# EAGLE design LPC_1 (EAGLE 6.4)
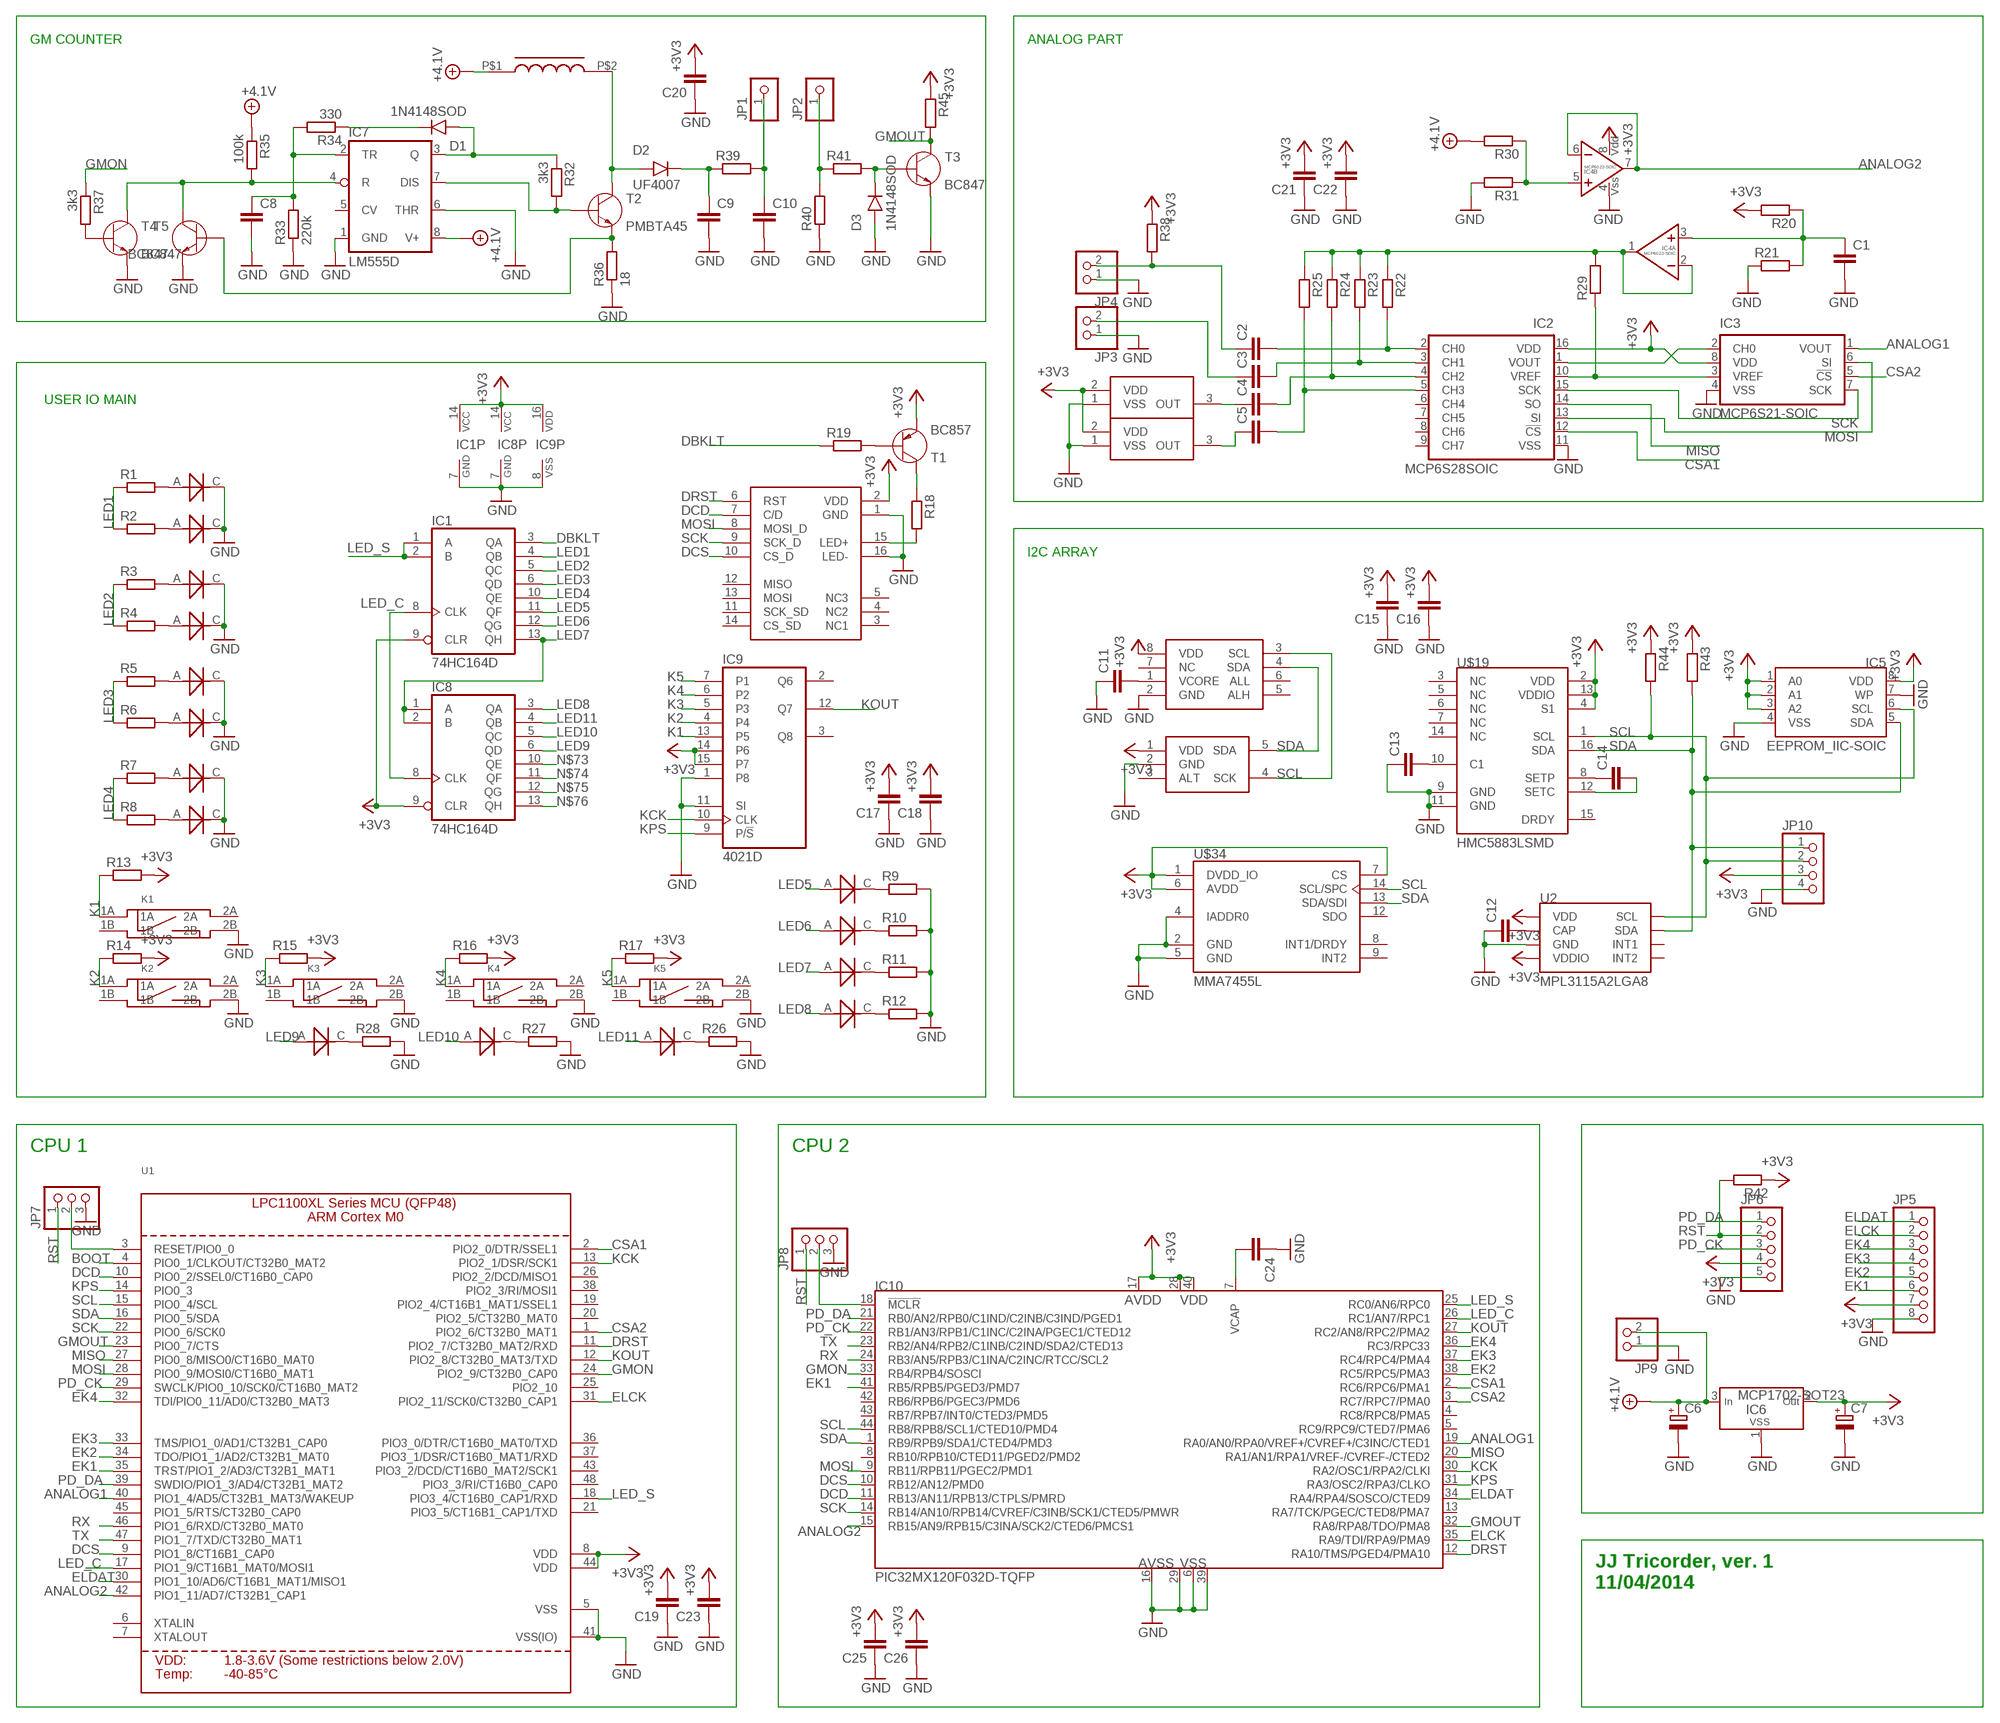
[diagram p0: schematic, sheet 1]

## Parts
C1  C_0806  [R0805]
C2  C_1206  [R1206]
C3  C_1206  [R1206]
C4  C_1206  [R1206]
C5  C_1206  [R1206]
C6  CPOL-EUSMCA  [SMC_A]
C7  CPOL-EUSMCA  [SMC_A]
C8  C_0806  [R0805]
C9  C_1206  [R1206]
C10  C_1206  [R1206]
C11  C_0806  [R0805]
C12  C_0806  [R0805]
C13  C_0806  [R0805]
C14  C_0806  [R0805]
C15  C_0806  [R0805]
C16  C_0806  [R0805]
C17  C_0806  [R0805]
C18  C_0806  [R0805]
C19  C_0806  [R0805]
C20  C_0806  [R0805]
C21  C_0806  [R0805]
C22  C_0806  [R0805]
C23  C_0806  [R0805]
C24  C_0806  [R0805]
C25  C_0806  [R0805]
C26  C_0806  [R0805]
D1  1N4148SOD  [SOD-80]
D2  UF4007  1N4007-SM  [SM-1]
D3  1N4148SOD  [SOD-80]
IC1  74HC164D  [SO14]
IC2  MCP6S28SOIC  [SO-16]
IC3  MCP6S21-SOIC  [SO-08]
IC4  MCP6022-SOIC  [SO-08]
IC5  EEPROM_IIC-SOIC  [SO-08]
IC6  MCP1702-SOT23  [SOT23]
IC7  LM555D  [SO08]
IC8  74HC164D  [SO14]
IC9  4021D  [SO16]
IC10  PIC32MX120F032D-TQFP  [TQFP44]
JP1  PINHD-1X1  [1X01]
JP2  PINHD-1X1  [1X01]
JP3  PINHD-1X02_2.54  [1X02]
JP4  PINHD-1X02_2.54  [1X02]
JP5  PINHD-1X08_2.54-S  [1X08-S]
JP6  PINHD-1X05_2.54-90°-S  [1X05/90-S]
JP7  PINHD-1X03_2.00  [1X03M]
JP8  PINHD-1X03_2.00  [1X03M]
JP9  PINHD-1X02_2.54-90°  [1X02/90]
JP10  PINHD-1X04_2.00  [1X04M]
K1  SWITCH_BD_B  [SW_SMD2]
K2  SWITCH_BD_B  [SW_SMD2]
K3  SWITCH_BD_B  [SW_SMD2]
K4  SWITCH_BD_B  [SW_SMD2]
K5  SWITCH_BD_B  [SW_SMD2]
R1  R_0805  [R0805]
R2  R_0805  [R0805]
R3  R_0805  [R0805]
R4  R_0805  [R0805]
R5  R_0805  [R0805]
R6  R_0805  [R0805]
R7  R_0805  [R0805]
R8  R_0805  [R0805]
R9  R_0805  [R0805]
R10  R_0805  [R0805]
R11  R_0805  [R0805]
R12  R_0805  [R0805]
R13  R_0805  [R0805]
R14  R_0805  [R0805]
R15  R_0805  [R0805]
R16  R_0805  [R0805]
R17  R_0805  [R0805]
R18  R_0805  [R0805]
R19  R_0805  [R0805]
R20  R_0805  [R0805]
R21  R_0805  [R0805]
R22  R_0805  [R0805]
R23  R_0805  [R0805]
R24  R_0805  [R0805]
R25  R_0805  [R0805]
R26  R_0805  [R0805]
R27  R_0805  [R0805]
R28  R_0805  [R0805]
R29  R_0805  [R0805]
R30  R_0805  [R0805]
R31  R_0805  [R0805]
R32  3k3  R_0805  [R0805]
R33  220k  R_0805  [R0805]
R34  330  R_0805  [R0805]
R35  100k  R_0805  [R0805]
R36  18  R_0805  [R0805]
R37  3k3  R_0805  [R0805]
R38  R_0805  [R0805]
R39  R_1206  [R1206]
R40  R_1206  [R1206]
R41  R_0805  [R0805]
R42  R_0805  [R0805]
R43  R_0805  [R0805]
R44  R_0805  [R0805]
R45  R_0805  [R0805]
T1  BC857  [SOT23]
T2  PMBTA45  BC847  [SOT23]
T3  BC847  [SOT23]
T4  BC847  [SOT23]
T5  BC847  [SOT23]
U1  LPC1113/4/5_QFP48_XLSERIES  [LQFP48]
U2  MPL3115A2LGA8  [LGA8]
U$1  LED5X2  [LED_5X2]
U$2  LED5X5  [LED_5X5]
U$3  DISP_TFT_18  [DSIP_TFT_18]
U$4  LED5X5  [LED_5X5]
U$5  LED5X5  [LED_5X5]
U$6  LED5X5  [LED_5X5]
U$7  LED5X5  [LED_5X5]
U$8  LED5X5  [LED_5X5]
U$9  LED5X5  [LED_5X5]
U$10  LED5X5  [LED_5X5]
U$11  LED5X2  [LED_5X2]
U$12  LED5X2  [LED_5X2]
U$13  LED5X2  [LED_5X2]
U$14  LED5X2  [LED_5X2]
U$15  LED5X2  [LED_5X2]
U$16  LED5X2  [LED_5X2]
U$17  HIH-6130  [SO8]
U$18  MCP9800  [SOT23-5]
U$19  HMC5883LSMD  [16LPCC]
U$20  IND_DL22  [IND_DL22]
U$21  TSL252  [TSL252]
U$22  TSL252  [TSL252]
U$34  MMA7455L  [LGA14]

## Nets
+3V3: C7.+ C15.2 C16.2 C17.2 C18.2 C19.2 C20.2 C21.2 C22.2 C23.2 C25.2 C26.2 IC1.9(CLR) IC1.14(VCC) IC2.16(VDD) IC3.8(VDD) IC4.8(VDD) IC5.1(A0) IC5.2(A1) IC5.3(A2) IC5.8(VDD) IC6.2(OUT) IC8.9(CLR) IC8.14(VCC) IC9.14(P6) IC9.15(P7) IC9.16(VDD) IC10.17(AVDD) IC10.28(VDD) IC10.40(VDD2) JP5.7 JP6.4 JP10.3 R13.2 R14.2 R15.2 R16.2 R17.2 R20.2 R38.1 R42.1 R43.1 R44.1 R45.1 T1.3(C) U1.8(VDD) U1.44(VDD) U2.1(VDD) U2.4(VDDIO) U$3.2(VDD) U$17.8(VDD) U$18.1(VDD) U$19.2(VDD) U$19.4(S1) U$19.13(VDDIO) U$21.2(VDD) U$22.2(VDD) U$34.1(DVDD_IO) U$34.6(AVDD) U$34.7(CS)
+4.1V: C6.+ IC6.3(IN) IC7.8(V+) JP9.2 R30.2 R35.1 U$20.P$1
ANALOG1: IC3.1(VOUT) IC10.19(RA0/AN0/RPA0/VREF+/CVREF+/C3INC/CTED1) U1.40(PIO1_4/AD5/CT32B1_MAT3/WAKEUP)
ANALOG2: IC4.6(B:IN-) IC4.7(B:VYSTUP) IC10.15(RB15/AN9/RPB15/C3INA/SCK2/CTED6/PMCS1) U1.42(PIO1_11/AD7/CT32B1_CAP1)
BOOT: U1.4(PIO0_1/CLKOUT/CT32B0_MAT2)
CSA1: IC2.12(!CS) IC10.2(RC6/RPC6/PMA1) U1.2(PIO2_0/DTR/SSEL1)
CSA2: IC3.5(!CS) IC10.3(RC7/RPC7/PMA0) U1.1(PIO2_6/CT32B0_MAT1)
DBKLT: IC1.3(QA) R19.1
DCD: IC10.11(RB13/AN11/RPB13/CTPLS/PMRD) U1.10(PIO0_2/SSEL0/CT16B0_CAP0) U$3.7(C/D)
DCS: IC10.10(RB12/AN12/PMD0) U1.9(PIO1_8/CT16B1_CAP0) U$3.10(CS_D)
DRST: IC10.12(RA10/TMS/PGED4/PMA10) U1.11(PIO2_7/CT32B0_MAT2/RXD) U$3.6(RST)
EK1: IC10.41(RB5/RPB5/PGED3/PMD7) JP5.6 U1.35(TRST/PIO1_2/AD3/CT32B1_MAT1)
EK2: IC10.38(RC5/RPC5/PMA3) JP5.5 U1.34(TDO/PIO1_1/AD2/CT32B1_MAT0)
EK3: IC10.37(RC4/RPC4/PMA4) JP5.4 U1.33(TMS/PIO1_0/AD1/CT32B1_CAP0)
EK4: IC10.36(RC3/RPC33) JP5.3 U1.32(TDI/PIO0_11/AD0/CT32B0_MAT3)
ELCK: IC10.35(RA9/TDI/RPA9/PMA9) JP5.2 U1.31(PIO2_11/SCK0/CT32B0_CAP1)
ELDAT: IC10.34(RA4/RPA4/SOSCO/CTED9) JP5.1 U1.30(PIO1_10/AD6/CT16B1_MAT1/MISO1)
GMON: IC10.33(RB4/RPB4/SOSCI) R37.1 U1.24(PIO2_9/CT32B0_CAP0)
GMOUT: IC10.32(RA8/RPA8/TDO/PMA8) R45.2 T3.3(C) U1.23(PIO0_7/CTS)
GND: C1.2 C6.- C7.- C8.2 C9.2 C10.2 C11.1 C12.1 C13.1 C15.1 C16.1 C17.1 C18.1 C19.1 C20.1 C21.1 C22.1 C23.1 C24.1 C25.1 C26.1 D3.A IC1.7(GND) IC2.11(VSS) IC3.4(VSS) IC4.4(VSS) IC5.4(VSS) IC5.7(WP) IC6.1(VSS) IC7.1(GND) IC7.6(THR) IC8.7(GND) IC9.1(P8) IC9.8(VSS) IC9.11(SI) IC10.6(VSS1) IC10.16(AVSS) IC10.29(VSS) IC10.39(VSS2) JP3.1 JP4.1 JP5.8 JP6.5 JP7.3 JP8.3 JP9.1 JP10.4 K1.2B K2.2B K3.2B K4.2B K5.2B R9.2 R10.2 R11.2 R12.2 R21.1 R26.2 R27.2 R28.2 R31.2 R33.1 R36.1 R40.1 T3.2(E) T4.2(E) T5.2(E) U1.5(VSS) U1.41(VSS(IO)) U2.3(GND) U$2.C U$3.1(GND) U$3.16(LED-) U$4.C U$5.C U$6.C U$7.C U$8.C U$9.C U$10.C U$17.2(GND) U$18.2(GND) U$19.9(GND) U$19.11(GND) U$21.1(VSS) U$22.1(VSS) U$34.2(GND) U$34.4(IADDR0) U$34.5(GND)
K1: IC9.13(P5) K1.1A R13.1
K2: IC9.4 K2.1A R14.1
K3: IC9.5(P3) K3.1A R15.1
K4: IC9.6(P2) K4.1A R16.1
K5: IC9.7(P1) K5.1A R17.1
KCK: IC9.10(CLK) IC10.30(RA2/OSC1/RPA2/CLKI) U1.13(PIO2_1/DSR/SCK1)
KOUT: IC9.12(Q7) IC10.27(RC2/AN8/RPC2/PMA2) U1.12(PIO2_8/CT32B0_MAT3/TXD)
KPS: IC9.9(P/!S) IC10.31(RA3/OSC2/RPA3/CLKO) U1.14(PIO0_3)
LED1: IC1.4(QB) R1.1 R2.1
LED2: IC1.5(QC) R3.1 R4.1
LED3: IC1.6(QD) R5.1 R6.1
LED4: IC1.10(QE) R7.1 R8.1
LED5: IC1.11(QF) U$13.A
LED6: IC1.12(QG) U$1.A
LED7: IC1.13(QH) IC8.1(A) IC8.2(B) U$11.A
LED8: IC8.3(QA) U$12.A
LED9: IC8.6(QD) U$16.A
LED10: IC8.5(QC) U$15.A
LED11: IC8.4(QB) U$14.A
LED_C: IC1.8(CLK) IC8.8(CLK) IC10.26(RC1/AN7/RPC1) U1.17(PIO1_9/CT16B1_MAT0/MOSI1)
LED_S: IC1.1(A) IC1.2(B) IC10.25(RC0/AN6/RPC0) U1.18(PIO3_4/CT16B0_CAP1/RXD)
MISO: IC2.14(SO) IC10.20(RA1/AN1/RPA1/VREF-/CVREF-/CTED2) U1.27(PIO0_8/MISO0/CT16B0_MAT0)
MOSI: IC2.13(SI) IC3.6(SI) IC10.9(RB11/RPB11/PGEC2/PMD1) U1.28(PIO0_9/MOSI0/CT16B0_MAT1) U$3.8(MOSI_D)
N$1: R1.2 U$2.A
N$2: R2.2 U$4.A
N$3: IC2.10(VREF) IC3.3(VREF) R29.1
N$5: R3.2 U$5.A
N$6: R4.2 U$6.A
N$7: C1.1 IC4.3(A:NEIN+) R20.1 R21.2
N$8: IC2.1(VOUT) IC3.2(CH0)
N$9: R5.2 U$7.A
N$10: R6.2 U$8.A
N$11: R26.1 U$14.C
N$12: R18.2 U$3.15(LED+)
N$13: R7.2 U$9.A
N$14: R8.2 U$10.A
N$15: R18.1 T1.2(E)
N$16: R19.2 T1.1(B)
N$17: R9.1 U$13.C
N$18: R10.1 U$1.C
N$19: R11.1 U$11.C
N$20: R12.1 U$12.C
N$21: C2.2 IC2.2(CH0) R22.2
N$22: C3.2 IC2.3(CH1) R23.2
N$23: C4.2 IC2.4(CH2) R24.2
N$24: C5.2 IC2.5(CH3) R25.2
N$25: R27.1 U$15.C
N$26: R28.1 U$16.C
N$28: IC4.1(A:VYSTUP) IC4.2(A:IN-) R22.1 R23.1 R24.1 R25.1 R29.2
N$31: IC4.5(B:NEIN+) R30.1 R31.1
N$32: D1.K R34.1
N$33: D1.A IC7.3(Q) R32.1
N$34: IC7.7(DIS) R32.2 T2.1(B)
N$35: IC7.4(R) R35.2 T4.3(C) T5.3(C)
N$36: C8.1 IC7.2(TR) R33.2 R34.2
N$37: R37.2 T4.1(B)
N$38: C9.1 D2.K R39.1
N$39: C10.1 JP1.1 R39.2
N$40: D2.A T2.3(C) U$20.P$2
N$41: JP2.1 R40.2 R41.1
N$42: D3.K R41.2 T3.1(B)
N$44: R36.2 T2.2(E) T5.1(B)
N$45: C11.2 U$17.1(VCORE)
N$46: C24.2 IC10.7(VCAP)
N$48: JP7.2 U1.3(RESET/PIO0_0)
N$51: C12.2 U2.2(CAP)
N$52: C13.2 U$19.10(C1)
N$53: C14.1 U$19.8(SETP)
N$54: C14.2 U$19.12(SETC)
N$55: C5.1 U$21.3(OUT)
N$56: C4.1 U$22.3(OUT)
N$57: IC10.18(!MCLR) JP8.2
N$58: C3.1 JP3.2
N$59: C2.1 JP4.2 R38.2
N$73: IC8.10(QE)
N$74: IC8.11(QF)
N$75: IC8.12(QG)
N$76: IC8.13(QH)
PD_CK: IC10.22(RB1/AN3/RPB1/C1INC/C2INA/PGEC1/CTED12) JP6.3 U1.29(SWCLK/PIO0_10/SCK0/CT16B0_MAT2)
PD_DA: IC10.21(RB0/AN2/RPB0/C1IND/C2INB/C3IND/PGED1) JP6.1 U1.39(SWDIO/PIO1_3/AD4/CT32B1_MAT2)
RST: JP6.2 JP7.1 JP8.1 R42.2
RX: IC10.24(RB3/AN5/RPB3/C1INA/C2INC/RTCC/SCL2) U1.46(PIO1_6/RXD/CT32B0_MAT0)
SCK: IC2.15(SCK) IC3.7(SCK) IC10.14(RB14/AN10/RPB14/CVREF/C3INB/SCK1/CTED5/PMWR) U1.22(PIO0_6/SCK0) U$3.9(SCK_D)
SCL: IC5.6(SCL) IC10.44(RB8/RPB8/SCL1/CTED10/PMD4) JP10.2 R44.2 U1.15(PIO0_4/SCL) U2.8(SCL) U$17.3(SCL) U$18.4(SCK) U$19.1(SCL) U$34.14(SCL/SPC)
SDA: IC5.5(SDA) IC10.1(RB9/RPB9/SDA1/CTED4/PMD3) JP10.1 R43.2 U1.16(PIO0_5/SDA) U2.7(SDA) U$17.4(SDA) U$18.5(SDA) U$19.16(SDA) U$34.13(SDA/SDI)
TX: IC10.23(RB2/AN4/RPB2/C1INB/C2IND/SDA2/CTED13) U1.47(PIO1_7/TXD/CT32B0_MAT1)
Unconnected: IC2.6(CH4) IC2.7(CH5) IC2.8(CH6) IC2.9(CH7) IC7.5(CV) IC9.2(Q6) IC9.3(Q8) IC10.4(RC8/RPC8/PMA5) IC10.5(RC9/RPC9/CTED7/PMA6) IC10.8(RB10/RPB10/CTED11/PGED2/PMD2) IC10.13(RA7/TCK/PGEC/CTED8/PMA7) IC10.42(RB6/RPB6/PGEC3/PMD6) IC10.43(RB7/RPB7/INT0/CTED3/PMD5) K1.1B K1.2A K2.1B K2.2A K3.1B K3.2A K4.1B K4.2A K5.1B K5.2A U1.6(XTALIN) U1.7(XTALOUT) U1.19(PIO2_4/CT16B1_MAT1/SSEL1) U1.20(PIO2_5/CT32B0_MAT0) U1.21(PIO3_5/CT16B1_CAP1/TXD) U1.25(PIO2_10) U1.26(PIO2_2/DCD/MISO1) U1.36(PIO3_0/DTR/CT16B0_MAT0/TXD) U1.37(PIO3_1/DSR/CT16B0_MAT1/RXD) U1.38(PIO2_3/RI/MOSI1) U1.43(PIO3_2/DCD/CT16B0_MAT2/SCK1) U1.45(PIO1_5/RTS/CT32B0_CAP0) U1.48(PIO3_3/RI/CT16B0_CAP0) U2.5(INT2) U2.6(INT1) U$3.3(NC1) U$3.4(NC2) U$3.5(NC3) U$3.11(SCK_SD) U$3.12(MISO) U$3.13(MOSI) U$3.14(CS_SD) U$17.5(ALH) U$17.6(ALL) U$17.7(NC) U$18.3(ALT) U$19.3(NC) U$19.5(NC) U$19.6(NC) U$19.7(NC) U$19.14(NC) U$19.15(DRDY) U$34.8(INT1/DRDY) U$34.9(INT2) U$34.12(SDO)

## Notes on the sheet
- GM COUNTER | ANALOG PART
- USER IO MAIN
- I2C ARRAY
- CPU 1 | CPU 2
- JJ Tricorder, ver. 1
  11/04/2014

## Library data of the parts
C1-C5 C8-C26 = _moja:C
C6 C7 = _rcl:CPOL-EU: POLARIZED CAPACITOR, European symbol
D1 D3 = _mcom4:1N4148
D2 = _mcom4:1N4007
IC1 IC8 = 74xx-eu:74*164: 8-bit parallel out SHIFT REGISTER
IC2 = _mcom5:MCP6S28
IC3 = _mcom5:MCP6S21
IC4 = _mcom5:MCP6022
IC5 = _mcom5:EEPROM_IIC
IC6 = _mcom5:MCP1702
IC7 = _linear:*555: TIMER
IC9 = 40xx:4021: 8-bit static SHIFT REGISTER
IC10 = _mcom5:PIC32MX120F032D
JP1 JP2 = pinhead:PINHD-1X1: PIN HEADER
JP3 JP4 JP9 = pinhead-2:PINHD-1X02: PIN HEADER
JP5 = pinhead-2:PINHD-1X08: PIN HEADER
JP6 = pinhead-2:PINHD-1X05: PIN HEADER
JP7 JP8 = pinhead-2:PINHD-1X03: PIN HEADER
JP10 = pinhead-2:PINHD-1X04: PIN HEADER
K1-K5 = _moja:SWITCH_BD
R1-R45 = _moja:R
T1 = _mcom5:BC857
T2-T5 = _mcom4:BC847
U1 = microbuilder:LPC1113/4/5_QFP48_XLSERIES: LPC1113/4/5 ARM Cortex M0 MCU (50MHz) - XL Series (FBD48/3x3) LPC1115FBD48/303: Max Frequency: 50MHz Flash: 64kB SRAM: 8kB ADC: 10-bit
U2 = SparkFun-Sensors:MPL3115A2: Altimeter/Pressure Sensor, I2C, 1.95V-3.6V supply, 50 to 110kPa
U$1 U$2 U$4-U$16 = _moja:LED
U$3 = _moja:DISP_TFT_18
U$17 = _moja:HIH-6130
U$18 = _moja:MCP9800
U$19 = SparkFun-Sensors:HMC5883L: 3 Axis Digital Compass IC
U$20 = _moja:IND_DL22
U$21 U$22 = _moja:TSL252
U$34 = mma7455l:MMA7455L: The MMA7455L is a Digital Output (I2C/SPI), low power, low profile capacitive micromachined accelerometer featuring signal conditioning, a low pass filter, temperature compensation, self-test, configurable to detect 0g through interrupt pins (INT1 or INT2), and pulse detect for quick motion detection.

## Board
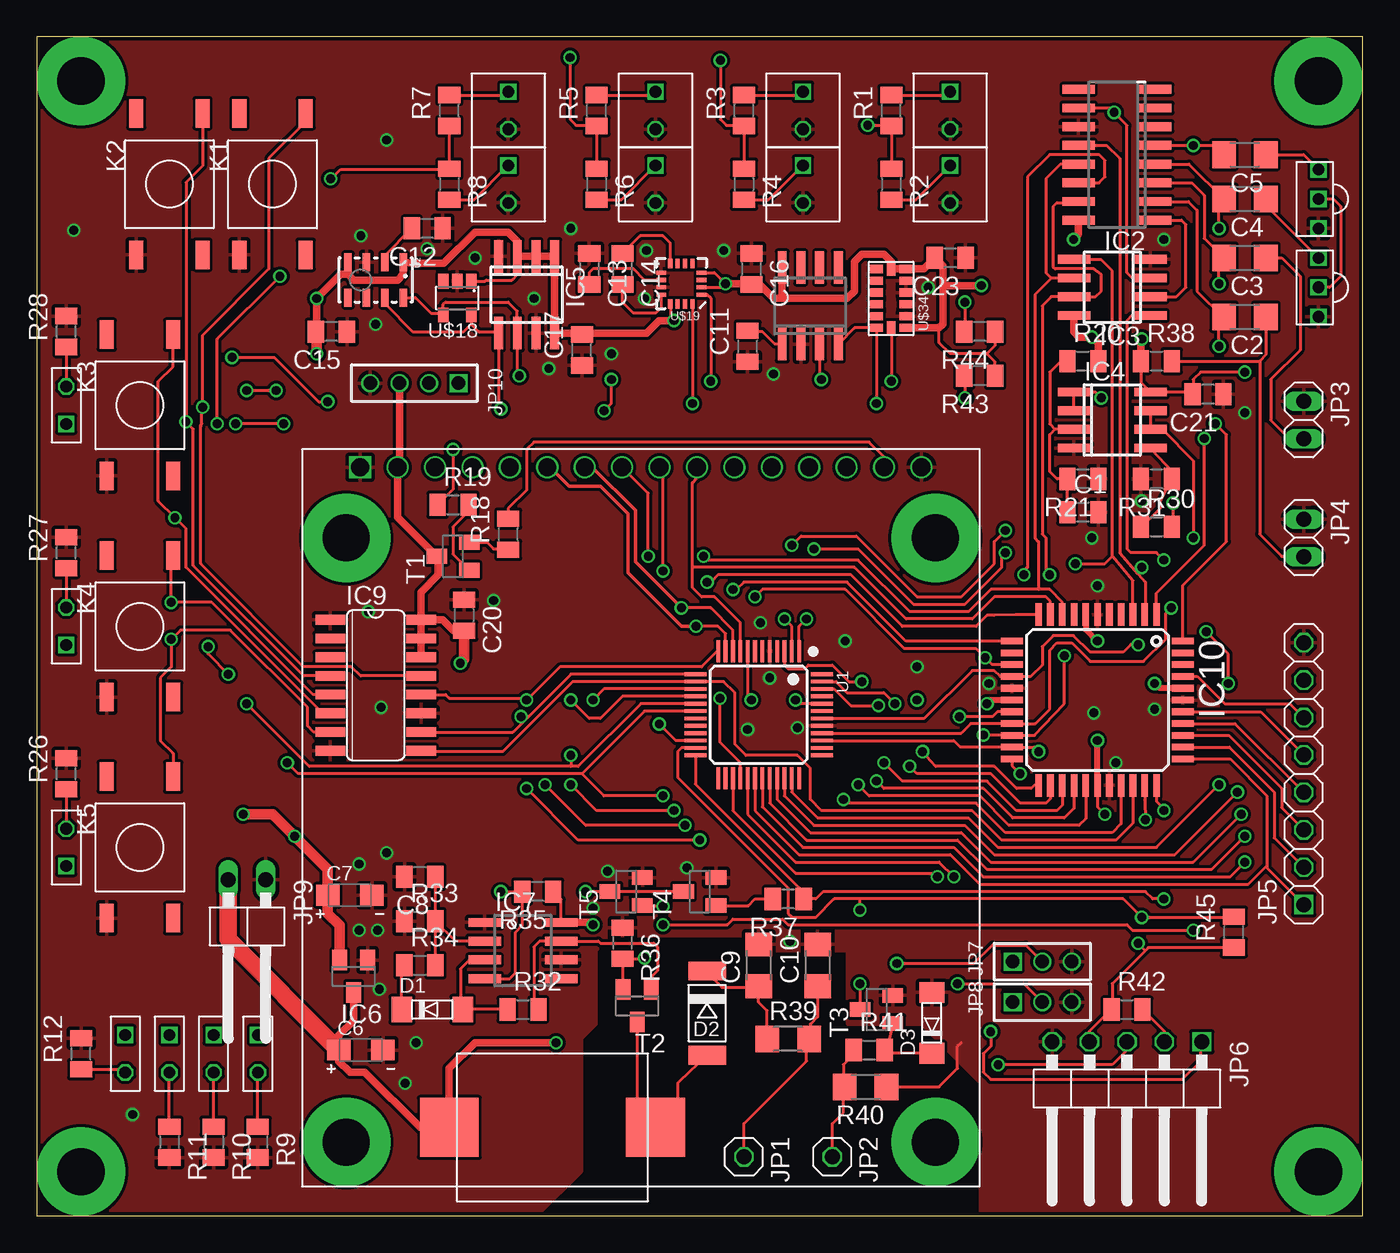
[diagram p1: board, top side]
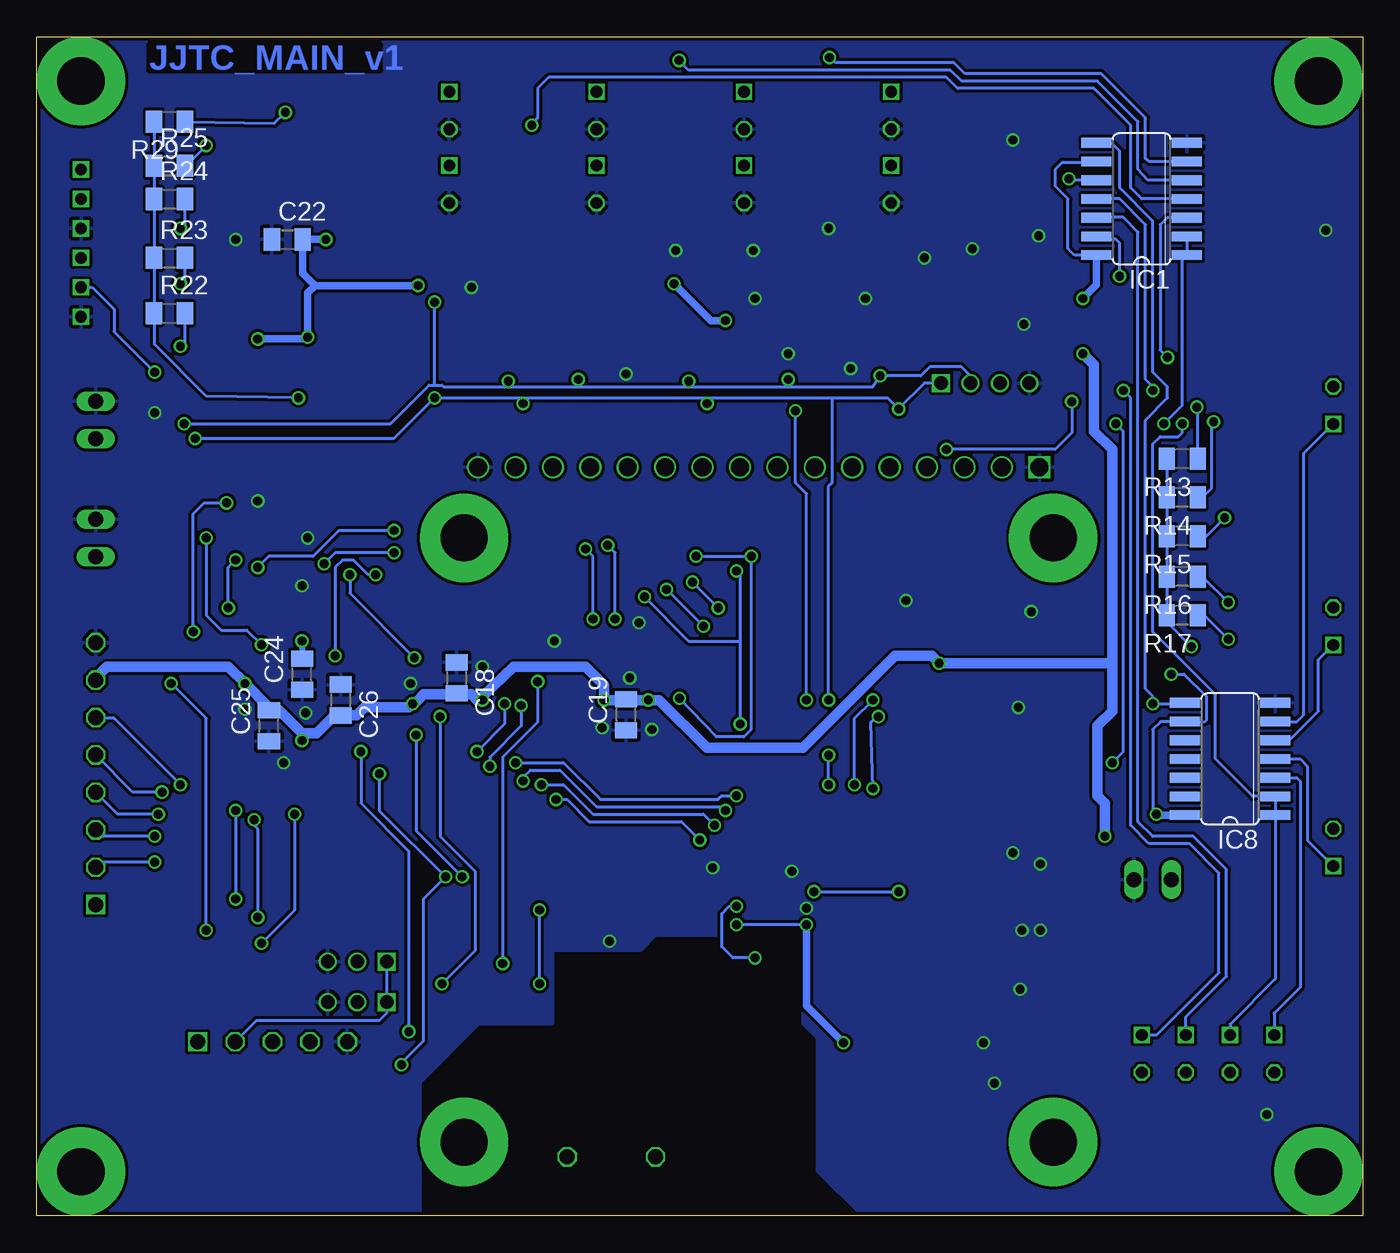
[diagram p2: board, bottom side, seen from below]

Size 90 x 80 mm. Coordinates in mm from the lower left corner, seen from the top.
Outline: 0,80 0,0 90,0 90,80 0,80
Copper layers (1*16): Top 0.035mm / dielectric 1.5mm / Bottom 0.035mm
Design rules "ch_6": minimum track width 0.15mm, minimum drill 0.4mm, track to track 0.2mm, track to pad 0.2mm, pad to pad 0.2mm, via to via 0.2mm, smd to smd 0.2mm, copper to edge 10mil, drill to drill 8mil, minimum pad ring 0.15mm, minimum via ring 0.15mm, stop-mask expansion 4mil, vias tented up to drill 0mil, thermal gap 10mil

### Footprints (pad centres in the part's own frame; a part is rotated, then mirrored left to right if it is on the bottom)
R0805 = smd 1.1 x 1.5: 1 -1.05,0; 2 1.05,0
R1206 = smd 1.6 x 1.803: 1 -1.422,0; 2 1.422,0
SMC_A = smd 1.6 x 1.4: + -1.5,0; - 1.5,0
SOD-80 = smd 1.397 x 1.702: A 1.905,0; K -2.223,0
SM-1 = smd 1.27 x 2.54: A 2.857,0; K -2.857,0
SO14 = smd 0.66 x 2.032: 1 -3.81,-3.073; 2 -2.54,-3.073; 3 -1.27,-3.073; 4 0,-3.073; 5 1.27,-3.073; 6 2.54,-3.073; 7 3.81,-3.073; 8 3.81,3.073; 9 2.54,3.073; 10 1.27,3.073; 11 0,3.073; 12 -1.27,3.073; 13 -2.54,3.073; 14 -3.81,3.073
SO-16 = smd 0.6 x 2.2: 1 -4.445,-2.917; 2 -3.175,-2.917; 3 -1.905,-2.917; 4 -0.635,-2.917; 5 0.635,-2.917; 6 1.905,-2.917; 7 3.175,-2.917; 8 4.445,-2.917; 9 4.445,2.283; 10 3.175,2.283; 11 1.905,2.283; 12 0.635,2.283; 13 -0.635,2.283; 14 -1.905,2.283; 15 -3.175,2.283; 16 -4.445,2.283
SO-08 = smd 0.6 x 2.2: 1 -1.905,-2.6; 2 -0.635,-2.6; 3 0.635,-2.6; 4 1.905,-2.6; 5 1.905,2.6; 6 0.635,2.6; 7 -0.635,2.6; 8 -1.905,2.6
SOT23 = smd 1 x 1.4: 1 -0.95,-1.1; 2 0.95,-1.1; 3 0,1.1
SO08 = smd 0.6 x 2.2: 1 -1.905,-2.6; 2 -0.635,-2.6; 3 0.635,-2.6; 4 1.905,-2.6; 5 1.905,2.6; 6 0.635,2.6; 7 -0.635,2.6; 8 -1.905,2.6
SO16 = smd 0.66 x 2.032: 1 -4.445,-3.073; 2 -3.175,-3.073; 3 -1.905,-3.073; 4 -0.635,-3.073; 5 0.635,-3.073; 6 1.905,-3.073; 7 3.175,-3.073; 8 4.445,-3.073; 9 4.445,3.073; 10 3.175,3.073; 11 1.905,3.073; 12 0.635,3.073; 13 -0.635,3.073; 14 -1.905,3.073; 15 -3.175,3.073; 16 -4.445,3.073
TQFP44 = smd 1.5 x 0.45: 1 -5.8,4; 2 -5.8,3.2; 3 -5.8,2.4; 4 -5.8,1.6; 5 -5.8,0.8; 6 -5.8,0; 7 -5.8,-0.8; 8 -5.8,-1.6; 9 -5.8,-2.4; 10 -5.8,-3.2; 11 -5.8,-4; 23 5.8,-4; 24 5.8,-3.2; 25 5.8,-2.4; 26 5.8,-1.6; 27 5.8,-0.8; 28 5.8,0; 29 5.8,0.8; 30 5.8,1.6; 31 5.8,2.4; 32 5.8,3.2; 33 5.8,4 | smd 0.45 x 1.5: 12 -4,-5.8; 13 -3.2,-5.8; 14 -2.4,-5.8; 15 -1.6,-5.8; 16 -0.8,-5.8; 17 0,-5.8; 18 0.8,-5.8; 19 1.6,-5.8; 20 2.4,-5.8; 21 3.2,-5.8; 22 4,-5.8; 34 4,5.8; 35 3.2,5.8; 36 2.4,5.8; 37 1.6,5.8; 38 0.8,5.8; 39 0,5.8; 40 -0.8,5.8; 41 -1.6,5.8; 42 -2.4,5.8; 43 -3.2,5.8; 44 -4,5.8
1X01 = drill 1.016 octagon: 1 0,0
1X02 = drill 1.016 long: 1 -1.27,0; 2 1.27,0
1X08-S = drill 1.016 square: 1 -8.89,0 | drill 1.016 octagon: 2 -6.35,0; 3 -3.81,0; 4 -1.27,0; 5 1.27,0; 6 3.81,0; 7 6.35,0; 8 8.89,0
1X05/90-S = drill 1.016 square: 1 -5.08,-3.81 | drill 1.016 octagon: 2 -2.54,-3.81; 3 0,-3.81; 4 2.54,-3.81; 5 5.08,-3.81
1X03M = drill 0.914 square: 1 -2,0 | drill 0.914: 2 0,0; 3 2,0
1X02/90 = drill 1.016 long: 1 -2.54,-3.81; 2 0,-3.81
1X04M = drill 0.914 square: 1 -3,0 | drill 0.914: 2 -1,0; 3 1,0; 4 3,0
SW_SMD2 = smd 1.93 x 0.965: 1A -4.8,2.25; 1B -4.8,-2.25; 2A 4.8,2.25; 2B 4.8,-2.25
LQFP48 = smd 1.5 x 0.25: 1 -4.3,2.75; 2 -4.3,2.25; 3 -4.3,1.75; 4 -4.3,1.25; 5 -4.3,0.75; 6 -4.3,0.25; 7 -4.3,-0.25; 8 -4.3,-0.75; 9 -4.3,-1.25; 10 -4.3,-1.75; 11 -4.3,-2.25; 12 -4.3,-2.75; 25 4.3,-2.75; 26 4.3,-2.25; 27 4.3,-1.75; 28 4.3,-1.25; 29 4.3,-0.75; 30 4.3,-0.25; 31 4.3,0.25; 32 4.3,0.75; 33 4.3,1.25; 34 4.3,1.75; 35 4.3,2.25; 36 4.3,2.75 | smd 0.25 x 1.5: 13 -2.75,-4.3; 14 -2.25,-4.3; 15 -1.75,-4.3; 16 -1.25,-4.3; 17 -0.75,-4.3; 18 -0.25,-4.3; 19 0.25,-4.3; 20 0.75,-4.3; 21 1.25,-4.3; 22 1.75,-4.3; 23 2.25,-4.3; 24 2.75,-4.3; 37 2.75,4.3; 38 2.25,4.3; 39 1.75,4.3; 40 1.25,4.3; 41 0.75,4.3; 42 0.25,4.3; 43 -0.25,4.3; 44 -0.75,4.3; 45 -1.25,4.3; 46 -1.75,4.3; 47 -2.25,4.3; 48 -2.75,4.3
LGA8 = smd 1.2 x 0.5: 1 -1.2,1.875; 2 -1.2,0.625; 3 -1.2,-0.625; 4 -1.2,-1.875; 5 1.2,-1.875; 6 1.2,-0.625; 7 1.2,0.625; 8 1.2,1.875
LED_5X2 = drill 0.8 square: A -1.27,0 | drill 0.8 octagon: C 1.27,0
LED_5X5 = drill 0.8 square: A -1.27,0 | drill 0.8 octagon: C 1.27,0
DSIP_TFT_18 = drill 1.2 square: 1 20.05,-23.8 | drill 1.2: 2 17.51,-23.8; 3 14.97,-23.8; 4 12.43,-23.8; 5 9.89,-23.8; 6 7.35,-23.8; 7 4.81,-23.8; 8 2.27,-23.8; 9 -0.27,-23.8; 10 -2.81,-23.8; 11 -5.35,-23.8; 12 -7.89,-23.8; 13 -10.43,-23.8; 14 -12.97,-23.8; 15 -15.51,-23.8; 16 -18.05,-23.8 | drill 3.2 pad 6: P$1 -19,-19; P$2 21,-19; P$3 -19,22; P$4 21,22
SO8 = smd 0.6 x 2.2: 1 -1.905,-2.6; 2 -0.635,-2.6; 3 0.635,-2.6; 4 1.905,-2.6; 5 1.905,2.6; 6 0.635,2.6; 7 -0.635,2.6; 8 -1.905,2.6
SOT23-5 = smd 0.7 x 1: 1 -0.99,-1.17; 2 -0.04,-1.17; 3 0.91,-1.17; 4 0.91,1.13; 5 -0.99,1.13
16LPCC = smd 0.65 x 0.28: 1 -1.37,0.75; 2 -1.37,0.25; 3 -1.37,-0.25; 4 -1.37,-0.75; 9 1.37,-0.75; 10 1.37,-0.25; 11 1.37,0.25; 12 1.37,0.75 | smd 0.28 x 0.65: 5 -0.75,-1.37; 6 -0.25,-1.37; 7 0.25,-1.37; 8 0.75,-1.37; 13 0.75,1.37; 14 0.25,1.37; 15 -0.25,1.37; 16 -0.75,1.37
IND_DL22 = smd 4 x 4: P$1 -7,0; P$2 7,0
TSL252 = drill 0.8 square: 1 2,0; 2 0,0; 3 -2,0
LGA14 = smd 0.9 x 0.55: 1 1,-2; 2 1,-1.2; 3 1,-0.4; 4 1,0.4; 5 1,1.2; 6 1,2; 8 -1,2; 9 -1,1.2; 10 -1,0.4; 11 -1,-0.4; 12 -1,-1.2; 13 -1,-2 | smd 0.6 x 0.9: 7 0,2; 14 0,-2

### Placement (x,y rotation side)
C1  71,47.75 0 top
C2  82,61 180 top
C3  82,65 180 top
C4  82,69 180 top
C5  82,72 180 top
C6  22,11.25 0 top
C7  21.25,21.75 0 top
C8  26,23 180 top
C9  49,17 90 top
C10  53,17 90 top
C11  48.25,59 90 top
C12  26.5,67 180 top
C13  37.5,64.25 270 top
C14  39.75,64.25 270 top
C15  20,60 180 top
C16  48.5,64.25 270 top
C17  37,58.75 90 top
C18  61.5,36.5 270 bottom
C19  50,34 90 bottom
C20  29,40.75 270 top
C21  79.5,55.75 180 top
C22  73,66.25 0 bottom
C23  62,65 180 top
C24  72,36.75 90 bottom
C25  74.25,33.25 90 bottom
C26  69.38,35 270 bottom
D1  27,14 0 top
D2  45.5,13.75 270 top
D3  60.75,13.25 90 top
IC1  15,69 90 bottom
IC2  73,72 90 top
IC3  73,63 90 top
IC4  73,54 270 top
IC5  33.25,62.5 180 top
IC6  21.5,16.25 180 top
IC7  33,18 270 top
IC8  9,31 90 bottom
IC9  23,36 270 top
IC10  72,35 270 top
JP1  48,4 270 top
JP2  54,4 270 top
JP3  86,54 270 top
JP4  86,46 270 top
JP5  86,30 90 top
JP6  74,8 180 top
JP7  68.25,17.25 0 top
JP8  68.25,14.5 0 top
JP9  13,19 180 top
JP10  25.62,56.5 180 top
K1  16,70 270 top
K2  9,70 270 top
K3  7,55 270 top
K4  7,40 270 top
K5  7,25 270 top
R1  58,75 90 top
R2  58,70 270 top
R3  48,75 90 top
R4  48,70 270 top
R5  38,75 90 top
R6  38,70 270 top
R7  28,75 90 top
R8  28,70 270 top
R9  15,5 270 top
R10  12,5 270 top
R11  9,5 270 top
R12  3,11 90 top
R13  12.25,51.38 180 bottom
R14  12.25,48.75 180 bottom
R15  12.25,46.12 180 bottom
R16  12.25,43.38 180 bottom
R17  12.25,40.75 180 bottom
R18  32,46.25 90 top
R19  28.25,48.25 0 top
R20  71,58 0 top
R21  71,50 180 top
R22  81,61.25 0 bottom
R23  81,65 0 bottom
R24  81,69 0 bottom
R25  81,71.25 0 bottom
R26  2,30 90 top
R27  2,45 90 top
R28  2,60 90 top
R29  81,74.25 180 bottom
R30  76,46.75 0 top
R31  76,50 180 top
R32  33,14 0 top
R33  26,20 0 top
R34  26,17 0 top
R35  34,22 180 top
R36  39.75,18.5 270 top
R37  51,21.5 180 top
R38  76,58 0 top
R39  51,12 0 top
R40  56.25,8.75 180 top
R41  56.5,11.25 0 top
R42  74,14 0 top
R43  64,57 180 top
R44  64,60 180 top
R45  81.25,19.25 90 top
T1  28.25,44.75 90 top
T2  40.75,14.25 180 top
T3  57,14 90 top
T4  45,22 90 top
T5  40,22 90 top
U1  49,34 270 top
U2  23,63.5 270 top
U$1  12,11 270 top
U$2  62,75 270 top
U$3  42,27 180 top
U$4  62,70 270 top
U$5  52,75 270 top
U$6  52,70 270 top
U$7  42,75 270 top
U$8  42,70 270 top
U$9  32,75 270 top
U$10  32,70 270 top
U$11  9,11 270 top
U$12  6,11 270 top
U$13  15,11 270 top
U$14  2,25 90 top
U$15  2,40 90 top
U$16  2,55 90 top
U$17  52.5,61.75 0 top
U$18  28.5,62.25 180 top
U$19  43.75,63.25 180 top
U$20  35,6 0 top
U$21  87,69 270 top
U$22  87,63 270 top
U$34  58,62.25 0 top

### Tracks (layer width: path | path; a pad name or v marks a point on that pad's centre or on a via)
+3V3  (via drill 0.6)
  Top 0.2: U$21.2 88,69 88.5,68.5 88.5,63.75 87.75,63 U$22.2 | R38.1 74.95,56.55 IC4.8 78.3,55.91 C21.2 78.5,55.8 78.5,56.75 79,57.25 v82,57.25 | R45.1 75.45,18.2 75.25,18 | 75.25,18 73,15.75 73,14.05 R42.1 71.46,12.51 JP6.4 | IC10.28 72,27.75 v72.5,27.25 | v74.75,18.5 75.25,18 | U1.8 48.25,35.25 v48.5,35 | U1.44 51.75,34.75 v51.5,35 | 27.25,44.65 T1.3 | U$19.13 43,61 v43.25,60.75 | C16.2 49.05,63.2 | 50.59,62.34 50.5,62.25 | U$18.1 30.42,63.42 30.5,63.5 32.25,63.5 32.62,63.87 IC5.3 | 36.9,59.9 C17.2 37.1,59.9 | R44.1 65.05,59.05 64.5,58.5 | 64.5,58.5 62,58.5 61.25,59.25 61.25,60.25 | R43.1 65.05,57.95 64.5,58.5 | v11.62,38.62 11.62,38.12 v13,36.75 | U$19.4 46,64 v46.75,63.25 46.5,63 U$19.2
  Top 0.4: IC10.28 v72,32.25 | IC10.17 64.75,35 v64.5,34.75 | IC10.40 76.2,35.8 v75.88,36.12
  Top 0.5: IC9.16 26.07,42.32 27.25,43.5 27.25,44.65 | T1.3 24.49,47.41 U$3.2 24.62,50.94 JP10.3 | 49.05,63.2 50,62.25 50.5,62.25 55,62.25 55.5,62.75 55.5,64.75 56,65.25 57.5,65.25 58,64.75 U$34.7 U$34.6 60.2,64.25 C23.2 61.5,64.45 61.5,63.12 | U$17.8 50.59,62.34 | v43.25,60.75 42.25,60.75 41.4,59.9 37.1,59.9 | U2.4 21.12,63.88 | 21.12,63.88 21.5,63.5 24.5,63.5 24.88,63.88 U2.1 24.93,64.7 25.5,64.62 27.62,64.62 29.75,66.75 32,66.75 32.62,66.14 IC5.3 IC5.2 IC5.1 IC5.8 36.9,59.9 | 19,59.95 C15.2 19,60.05 v19,62.25 20.62,63.88 21.12,63.88 | 29,37.75 v28.75,37.5 | IC9.16 27.55,40.45 28.25,39.75 28.95,39.75 C20.2 | IC9.16 IC9.15 IC9.14 | U$34.1 61.25,60.25 61.5,60.5 61.5,63.12 | v64.12,63.12 61.5,63.12 | IC2.16 70.72,66.59 v70.38,66.25 | R20.2 72.05,59.2 v71.62,59.62 70.75,59.62 70.4,59.98 IC3.8 | R38.1 74.95,59.45 v75,59.5 | v46.75,63.25 48.45,63.25 C16.2
  Top 0.7: IC6.2 20.55,19.7 19.75,20.5 C7.+ 19.75,23.5 v17.5,25.75 16,27.25 v14,27.25 | v19,58.5 19,59.95 | C20.2 29,37.75
  Bottom 0.2: U$22.2 86.25,63 84.75,61.5 84.75,60 v82,57.25 | C26.2 69.8,33.95 | v72.5,27.25 72.5,20.75 v74.75,18.5 | 49.95,35 C19.2 50.05,35 | v14,27.25 14.25,27.5 14.25,33 13.71,33.54 IC8.9 12.03,33.5 10.75,33.5 10.62,33.62 10.62,35.25 12.12,36.75 v13,36.75 | R13.2 R14.2 R15.2 R16.2 R17.2 13.3,40.3 v11.62,38.62 | 61.58,35.38 C18.2 61.42,35.38 | IC1.14 19.57,65.19 20,65.62 20,69 20.88,69.88 20.88,71 20.38,71.5 18.11,71.5 IC1.9 18.16,71.62
  Bottom 0.5: IC8.14 13.94,27.19 v14,27.25 | IC1.14 18.07,63.18 v19,62.25 | v70.38,66.25 C22.2 71.95,63.95 71.12,63.12 | 71.12,63.12 v64.12,63.12 | 71.12,63.12 71.62,62.62 v71.62,59.62 71.75,59.5 v75,59.5 | v43.25,60.75 44.25,60.75 v46.75,63.25 | 64.25,34.88 64.12,35 | v59.75,35 59.75,35.25
  Bottom 0.7: 69.8,33.95 71,32.75 72,32.75 | v72,32.25 72,32.75 | 64.25,34.88 v64.5,34.75 64.75,34.5 67.75,34.5 68.3,33.95 C26.2 | v17.5,25.75 17.5,28 18,28.5 18,33.25 17,34.25 17,37.5 | 17,37.5 17,52 18.25,53.25 18.25,57.75 v19,58.5 | 17,37.5 v28.75,37.5 29.25,38 31.75,38 38,31.75 44.5,31.75 47.75,35 v48.5,35 49.95,35 v51.5,35 51.5,36 52.75,37.25 57.62,37.25 59.75,35.25 | 64.12,35 63.75,35.38 61.58,35.38 | v59.75,35 60.12,35 60.5,35.38 61.42,35.38 | 72,32.75 73.55,34.3 C25.2 74.25,34.5 v75.88,36.12 77,37.25 85.25,37.25 86,36.5 JP5.7
+4.1V  (via drill 0.6)
  Top 0.2: IC7.8 35.6,21.45 R35.1 | U$20.P$1 26,6 | v42.5,19.75 46.88,19.75 47.25,20.12 50.62,20.12 51,19.75 74,19.75 74.38,19.38 v78.5,19.38 | v77.12,48.38 77.12,47.08 R30.2 | v80.88,36.12 80.88,38.12 v79.38,39.62
  Top 0.5: IC6.3 21.5,13.25 20.5,12.25 C6.+ 20.5,10.5 21.25,9.75 22.25,9.75 26,6 | IC7.8 37.59,19.91 v37.75,19.75 | v35.25,11.75 29.75,11.75 28,10 U$20.P$1
  Top 1.2: JP9.2 13,18.75 C6.+
  Bottom 0.2: v37.75,19.75 v42.5,19.75 | v78.5,19.38 78.5,33.75 v80.88,36.12 | v79.38,39.62 79.38,47.62 78.62,48.38 v77.12,48.38
  Bottom 0.5: v37.75,19.75 37.75,14.25 v35.25,11.75
ANALOG1  (via drill 0.6)
  Top 0.2: U1.40 62.75,32.75 63.4,33.4 IC10.19 67.78,33.4 68.75,34.38 68.75,38.38 69.25,38.88 70.25,38.88 71.5,37.62 75.12,37.62 76.62,39.12 76.62,40.88 v77,41.25 | IC3.1 74.34,61.09 74,60.75 74,45.25 74.25,45 76,45 v76.5,44.5
  Bottom 0.2: v77,41.25 77,44 v76.5,44.5
ANALOG2  (via drill 0.6)
  Top 0.2: U1.42 60.25,33.75 63.5,37 65,37 65.4,36.6 IC10.15 67.47,36.6 68.25,37.38 68.25,38.62 69,39.38 70.38,39.38 71.5,38.25 73.75,38.25 74.25,38.75 v74.75,38.75 | IC4.7 IC4.6 76.39,53.37 78.5,51.25 v78.5,46
  Bottom 0.2: v78.5,46 78.5,40.75 77.5,39.75 75.75,39.75 v74.75,38.75
CSA1  (via drill 0.6)
  Top 0.2: IC2.12 72.61,72.64 73.5,71.75 73.5,45 74.75,43.57 | 74.75,43.57 75.25,43 75.25,40.85 IC10.2 | U1.2 51.25,40 v50.75,40.5 | v51.25,45.5 51.88,46.12 55.62,46.12 59.75,42 62.75,42 65,44.25 65,45.75 v65.75,46.5 | v75,44 75.19,44 74.75,43.57
  Bottom 0.2: v50.75,40.5 50.75,45 v51.25,45.5 | v65.75,46.5 69.5,46.5 71.25,44.75 74.25,44.75 v75,44
CSA2  (via drill 0.6)
  Top 0.2: IC10.3 74.4,43.1 73,44.75 | 73,44.75 73,64.12 72.22,64.91 IC3.5 | U1.1 51.75,40 v52.25,40.5 | v52.75,45.25 55.75,45.25 59.5,41.5 63,41.5 65.5,44 65.5,44.75 v65.75,45 | v70.5,44.25 72.5,44.25 73,44.75
  Bottom 0.2: v52.25,40.5 52.25,44.75 v52.75,45.25 | v65.75,45 69.75,45 v70.5,44.25
DBKLT  (via drill 0.6)
  Top 0.2: v13.25,58.25 16.12,58.25 19.12,55.25 v19.75,55.25 | v28.25,52 28.25,49.3 R19.1
  Bottom 0.2: IC1.3 13.27,67.73 13.75,67.25 13.75,58.75 v13.25,58.25 | v19.75,55.25 19.75,53.12 20.88,52 v28.25,52
DCD  (via drill 0.6)
  Top 0.2: U1.10 47.25,39.75 45.75,41.25 v43.75,41.25 | IC10.11 66.45,40.8 65,40.75 64.5,40.75 63.75,40 58.75,40 55.25,43.5 46.25,43.5 45.75,43 v45.5,43
  Top 0.25: U$3.7 37.7,50.8 40.62,47.88 40.62,44.38 v43.75,41.25
  Bottom 0.2: v45.5,43 v43.75,41.25
DCS
  Top 0.2: U1.9 47.75,40.25 46,42 45.12,42 44.5,42.62 44.5,44 | 44.5,44 44.5,49.75 44.75,50 44.75,50.73 U$3.10 | IC10.10 68.8,41.7 68.5,42 65,42 63.5,40.5 59,40.5 55.5,44 44.5,44
DRST  (via drill 0.6)
  Top 0.2: U1.11 46.75,39.5 46.25,40 v44.75,40 | IC10.12 59,39 55,43 48,43 47.5,42.5 v47.25,42.5
  Top 0.25: U$3.6 34.83,50.8 36.12,49.5 38.25,49.5 40.12,47.62 40.12,43.62 43.75,40 v44.75,40
  Bottom 0.2: v47.25,42.5 v44.75,40
EK1  (via drill 0.6)
  Top 0.2: U1.35 51.25,28.75 53,27 63.25,27 65.25,25 76,25 v80.25,29.25 | IC10.41 78.78,36.6 80.62,34.75 85.06,34.75 JP5.6
  Bottom 0.2: v80.25,29.25 84.75,33.75 85.94,33.75 JP5.6
EK2  (via drill 0.6)
  Top 0.2: IC10.38 83.07,34.2 JP5.5 | U1.34 50.75,28.5 52.75,26.5 63,26.5 65,24.5 77.25,24.5 v81.5,28.75
  Bottom 0.2: v81.5,28.75 83.48,28.75 JP5.5
EK3  (via drill 0.6)
  Top 0.2: IC10.37 81.33,33.4 JP5.4 | U1.33 50.25,28.25 52.5,26 62.75,26 64.75,24 78.5,24 v81.75,27.25
  Bottom 0.2: v81.75,27.25 84.52,27.25 JP5.4
EK4  (via drill 0.6)
  Top 0.2: IC10.36 80.9,32.6 84.5,29 84.5,27.69 JP5.3 | U1.32 49.75,28 52.25,25.5 62.5,25.5 64.5,23.5 79.75,23.5 v82,25.75
  Bottom 0.2: v82,25.75 85.56,25.75 JP5.3
ELCK  (via drill 0.6)
  Top 0.2: IC10.35 80.95,31.8 84,28.75 84,25.65 JP5.2 | U1.31 49.25,27.75 52,25 62.25,25 64.25,23 81,23 v82,24
  Bottom 0.2: v82,24 85.65,24 JP5.2
ELDAT
  Top 0.2: IC10.34 81,31 83.5,28.5 83.5,23.75 | 83.5,23.75 83.5,23.61 JP5.1 | U1.30 48.75,27.5 51.75,24.5 62,24.5 64,22.5 82.25,22.5 83.5,23.75
GMON  (via drill 0.6)
  Top 0.2: IC10.33 76,28.12 76.5,27.62 v76.5,27.5 | v76.5,21.5 75.75,21.5 75.25,22 53.38,22 52.88,21.5 R37.1 52.05,22 51.25,22.75 44.7,29.3 U1.24
  Bottom 0.2: v76.5,27.5 v76.5,21.5
GMOUT  (via drill 0.6)
  Top 0.2: IC10.32 75.2,28.2 v75.25,26.88 | 55.88,21.5 73.75,21.5 v75,20.25 81.2,20.25 R45.2 | 55.88,21.5 54.12,21.5 52.88,20.25 51.25,20.25 51,20.5 51,22.25 43.5,29.75 43.5,31.5 43.75,31.75 U1.23 | T3.3 55.9,15.72 v55.88,15.75 | v55.88,20.75 55.88,21.5
  Bottom 0.2: v75.25,26.88 75.25,26.5 75,26.25 v75,20.25 | v55.88,15.75 v55.88,20.75
GND  (via drill 0.6)
  Top 0.2: R40.1 61.25,8.75 62.5,10 62.5,11.5 62.75,11.75
  other vias: 23.75,73 64.62,36.12 71.75,34.12 72,42.75 73.25,30.75 75,48.5 41.25,62.25 41.38,65.5 60.5,63 29.75,65 33.75,62.25 26.5,65.62 22,66.5 23,60.5 22.5,41 31,41.75 34.75,57.5 39,58.5 36.25,67 51.62,33.12 49.75,36.5 49.12,40.25 76.5,66.25 54.88,39 59.75,37.25 48.25,33 44.12,23.62 38.75,23.38 37.75,20.88 51.12,18.62 21.88,19.38 23.12,19.38 23.25,15.38 25.75,11.75 25,9 21.88,23.88 23.75,24.62 6.5,6.88 2.5,66.88 82,54.5 71.62,46 23.38,34.5 46.62,65.5 50,57.12 75.88,34.38
  pour Bottom: 0,80 0,0 34,0 37,3 37,12 38,13 38,18 39,19 48,19 49,18 55,18 55,13 60,13 64,9 64,0 90,0 90,80
  pour Top: 0,80 0,0 34,0 37,3 37,12 38,13 38,18 39,19 48,19 49,18 55,18 55,13 60,13 64,9 64,0 90,0 90,80
K1  (via drill 0.6)
  Top 0.2: K1.1A 18.25,74.25 15.75,71.75 15.75,64.25 11.25,59.75 v11.25,54.88 11.2,54.83 11.2,53.75 11.12,53.58 11.12,44.25 18.07,37.27 21.32,37.27 21.99,36.63 IC9.13
  Bottom 0.2: R13.1 11.2,54.83 v11.25,54.88
K2  (via drill 0.6)
  Top 0.2: K2.1A 11.25,71.25 10.12,70.12 v10.12,53.88 10.62,53.38 10.62,44.12 18.11,36.63 IC9.4
  Bottom 0.2: R14.1 10.88,48.75 10.25,49.38 10.25,53.75 v10.12,53.88
K3  (via drill 0.6)
  Top 0.2: K3.1A 9.25,57.62 8.25,56.62 8.25,48.5 v9.38,47.38 10.12,46.62 10.12,44 18.76,35.37 IC9.5
  Bottom 0.2: R15.1 10.62,46.12 v9.38,47.38
K4  (via drill 0.6)
  Top 0.2: K4.1A 9.12,44.67 v9.12,41.62 11.88,41.62 19.41,34.09 IC9.6
  Bottom 0.2: R16.1 10.88,43.38 v9.12,41.62
K5  (via drill 0.6)
  Top 0.2: K5.1A 9.25,31.38 8.38,32.25 8.38,36.5 9.12,37.25 v9.12,39.12 9.75,39.75 13.12,39.75 18.38,34.5 18.38,33.25 18.8,32.83 IC9.7
  Bottom 0.2: R17.1 10.75,40.75 v9.12,39.12
KCK  (via drill 0.6)
  Top 0.2: U1.13 36.25,36.75 33.38,33.88 | 33.38,33.88 32.33,32.83 IC9.10 | IC10.30 73.6,26.6 73,26 65.75,26 63.75,28 55,28 v54.75,28.25 | v45,25.5 36.75,25.5 v33.25,29 | v32.88,33.88 33.38,33.88
  Bottom 0.2: v33.25,29 33.38,33.5 v32.88,33.88 | v54.75,28.25 54,28.25 52.5,26.75 46.25,26.75 v45,25.5
KOUT  (via drill 0.6)
  Top 0.2: U1.12 46.17,38.3 45.12,37.25 35.5,37.25 v33.25,35 33.12,35.12 28,35.12 27.76,35.37 IC9.12 | IC10.27 71.2,26.95 70.75,26.5 66,26.5 64,28.5 56.5,28.5 v55.75,29.25 | v44,26.5 37.25,26.5 v34.5,29.25
  Bottom 0.2: v55.75,29.25 54.25,29.25 52.25,27.25 44.75,27.25 v44,26.5 | v34.5,29.25 34.5,33.75 v33.25,35
KPS
  Top 0.2: IC9.9 26.13,31.5 31.62,31.5 36.38,36.25 U1.14 46.62,36.25 47.38,35.5 47.38,32 48.12,31.25 51.62,31.25 52.5,30.38 52.5,28.25 53.25,27.5 63.5,27.5 65.5,25.5 73.25,25.5 74.4,26.65 IC10.31
LED1  (via drill 0.6)
  Top 0.2: R2.1 R1.1 57.95,74 v56.4,74
  Bottom 0.2: IC1.4 15,69 15.75,69.75 15.75,74 18.25,76.5 27.5,76.5 28.25,77.25 55.25,77.25 56,76.5 56,74.5 v56.4,74
LED2  (via drill 0.6)
  Top 0.2: R4.1 R3.1 47.95,74 46.8,74 46.4,74.4 v46.4,78.4
  Bottom 0.2: IC1.5 14.57,70.27 15.25,71 15.25,74.25 18,77 27.2,77 28,77.75 45.75,77.75 v46.4,78.4
LED3  (via drill 0.6)
  Top 0.2: R6.1 R5.1 37.95,74 36.6,74 36.2,74.4 v36.2,78.6
  Bottom 0.2: IC1.6 14.44,71.54 14.75,71.75 14.75,74.5 17.75,77.5 27,77.5 27.75,78.25 35.75,78.25 v36.2,78.6
LED4  (via drill 0.6)
  Top 0.2: R7.1 R8.1 27.95,71 20.62,71 20,70.38 v19.95,70.38
  Bottom 0.2: IC1.10 19.84,70.27 v19.95,70.38
LED5  (via drill 0.6)
  Top 0.2: v16.25,56 v14.25,56
  Bottom 0.2: U$13.A 13.98,12.27 9.75,16.5 9.75,23.25 11.75,25.25 14.5,25.25 15.75,26.5 15.75,55.5 v16.25,56 | v14.25,56 14.25,56.25 14.75,56.75 14.75,67.25 16.5,69 IC1.11
LED6
  Bottom 0.2: U$1.A 12,13.5 9.25,16.25 9.25,23.5 11.5,25.75 14.25,25.75 15.25,26.75 15.25,66.75 16.25,67.75 18.05,67.75 IC1.12
LED7  (via drill 0.6)
  Top 0.2: v12.25,53.75 12.25,59.5 v16.5,63.75
  Bottom 0.2: U$11.A 9,13 5.93,16.07 IC8.1 IC8.2 7.46,28.46 10,31 10,35.38 14.25,39.62 14.25,52.38 13.75,52.88 12.5,52.88 12.25,53.12 v12.25,53.75 | v16.5,63.75 16.5,66 16.75,66.25 17.86,66.25 IC1.13
LED8
  Bottom 0.2: IC8.3 4.48,29.73 4.25,29.5 4.25,15.5 6,13.75 U$12.A
LED9
  Bottom 0.2: IC8.6 4.46,33.54 4,34 4,51.73 U$16.A
LED10
  Bottom 0.2: IC8.5 4.98,32.27 3,34.25 3,37.73 U$15.A
LED11
  Bottom 0.2: IC8.4 4.25,31 3.75,30.5 3.75,25.48 U$14.A
LED_C  (via drill 0.6)
  Top 0.2: U1.17 41,34.75 36.75,30.5 36.25,30.5 | 36.25,30.5 18.5,30.5 v14.25,34.75 | IC10.26 70.4,27.65 69.75,27 66.25,27 64.25,29 57.5,29 v57,29.5 | v43.25,27.5 38,27.5 v36.25,29.25 | v36.25,31.25 36.25,30.5
  Bottom 0.2: IC8.8 12.13,34.75 v14.25,34.75 14.25,35.25 14.75,35.75 14.75,54 13.25,55.5 13.25,56.25 14.25,57.25 14.25,67.5 16.5,69.75 16.5,72.25 17,72.75 18.01,72.75 IC1.8 | v57,29.5 57,29.75 56.5,30.25 54.5,30.25 52,27.75 43.5,27.75 v43.25,27.5 | v36.25,29.25 v36.25,31.25
LED_S  (via drill 0.6)
  Top 0.2: U1.18 41.25,34.25 37,30 | 37,30 17.75,30 v17,30.75 | v16.75,53.75 v13.5,53.75 | IC10.25 69.6,27.85 69.25,27.5 66.5,27.5 64.5,29.5 58.75,29.5 v57.5,30.75 | v42.5,28.5 38.5,28.5 37,30
  Bottom 0.2: v17,30.75 16.25,31.5 16.25,53.25 v16.75,53.75 | v13.5,53.75 12.25,55 12.25,64.87 IC1.1 IC1.2 | v57.5,30.75 54.25,30.75 51.75,28.25 43.75,28.25 43.5,28.5 v42.5,28.5
MISO  (via drill 0.6)
  Top 0.2: U1.27 47.25,27.5 51.5,23.25 61,23.25 v61.12,23 | v64.25,32.62 64.4,32.6 IC10.20 67.72,32.6 69.75,34.75 v69.75,38 | IC2.14 72.09,70.09 72.5,70.5 72.5,71.62 72.12,72 68.75,72 67.25,70.5 67.25,44 67,43.75 v67,43.5
  Bottom 0.2: v67,43.5 67.5,43.5 68.5,44.5 69.25,44.5 69.75,44 v69.75,38 | v64.25,32.62 64.25,26.12 v61.12,23
MOSI  (via drill 0.6)
  Top 0.2: IC10.9 69.6,41.65 68.75,42.5 68,42.5 | 68,42.5 64.75,42.5 63.25,41 59.25,41 55.75,44.5 45.5,44.5 v45.25,44.75 | v41.5,44.75 41.5,49.03 U$3.8 | IC2.13 69.49,71.36 68.5,70.38 68.5,64 68.86,63.63 | IC3.6 68.86,63.63 | 68.86,63.63 68.86,63.62 67.75,62.5 67.75,46 68,45.75 68,42.5 | U1.28 47.75,30.75 46.38,32.12 v46.38,35.12
  Bottom 0.2: v45.25,44.75 v41.5,44.75 41.5,33 42,32.5 43.88,32.5 v46.38,35.12
N$1
  Top 0.2: R1.2 61.78,76.05 U$2.A
N$2
  Top 0.2: R2.2 59.68,68.95 U$4.A
N$3  (via drill 0.6)
  Top 0.2: IC3.3 74.36,63.63 74,64 74,74 v73.12,74.88 72.83,75.17 IC2.10
  Bottom 0.2: R29.1 73.88,74.12 v73.12,74.88
N$4  (via drill 3.2 pad 6)
  other vias: 3,77
N$5
  Top 0.2: R3.2 51.78,76.05 U$5.A
N$6
  Top 0.2: R4.2 49.68,68.95 U$6.A
N$7
  Top 0.2: IC4.3 69.11,53.37 | 69.11,53.37 68.75,53 68.75,50.5 69.25,50 R21.2 C1.1 | R20.1 69.5,58 68.75,57.25 68.75,53.73 69.11,53.37
N$8
  Top 0.2: IC2.1 77.69,67.56 78,67.25 78,63 77.36,62.37 IC3.2
N$9
  Top 0.2: R5.2 41.78,76.05 U$7.A
N$10
  Top 0.2: R6.2 39.68,68.95 U$8.A
N$11
  Top 0.2: R26.1 U$14.C
N$12
  Top 0.2: U$3.15 57.51,51.49 56.5,52.5 33.75,52.5 33.25,52 33.25,49.25 32,48 R18.2
N$13
  Top 0.2: R7.2 31.78,76.05 U$9.A
N$14
  Top 0.2: R8.2 29.68,68.95 U$10.A
N$15
  Top 0.2: T1.2 30.55,45.7 31,45.25 31.95,45.25 R18.1
N$16
  Top 0.2: R19.2 29.3,47.8 28.25,46.75 28.25,44.9 T1.1
N$17
  Top 0.2: R9.1 U$13.C
N$18
  Top 0.2: R10.1 U$1.C
N$19
  Top 0.2: R11.1 U$11.C
N$20
  Top 0.2: R12.1 5.78,9.95 U$12.C
N$21  (via drill 0.6)
  Top 0.2: IC2.2 78.17,68.83 78.75,68.25 78.75,62.75 80.5,61 80.5,61.08 C2.2 80.25,60.67 v80.25,59
  Bottom 0.2: R22.2 79.95,59.3 v80.25,59
N$22  (via drill 0.6)
  Top 0.2: IC2.3 78.41,70.09 79.25,69.25 79.25,66.33 C3.2 80.25,64.67 v80.25,63.25
  Bottom 0.2: R23.2 79.95,63.55 v80.25,63.25
N$23  (via drill 0.6)
  Top 0.2: IC2.4 78.21,71.36 C4.2 80.25,68.67 v80.25,67
  Bottom 0.2: R24.2 79.95,67.3 v80.25,67
N$24  (via drill 0.6)
  Top 0.2: IC2.5 78.5,72.64 | 78.5,72.64 79.94,72.64 C5.2 | v78.5,72.62 78.5,72.64
  Bottom 0.2: R25.2 79.88,71.25 v78.5,72.62
N$25
  Top 0.2: R27.1 U$15.C
N$26
  Top 0.2: R28.1 U$16.C
N$27  (via drill 3.2 pad 6)
  other vias: 3,3
N$28  (via drill 0.6)
  Top 0.2: IC4.2 IC4.1 71.84,55.91 v72.25,55.5
  Bottom 0.2: v72.25,55.5 78.5,55.62 82,59.12 82,61.2 R22.1 R23.1 R24.1 R25.1 R29.2
N$29  (via drill 3.2 pad 6)
  other vias: 87,77
N$30  (via drill 3.2 pad 6)
  other vias: 87,3
N$31
  Top 0.2: IC4.5 77.1,50.45 R31.1 76.25,48.45 76.25,48 75.25,47 R30.1
N$32
  Top 0.2: D1.K 24.78,16.83 R34.1
N$33
  Top 0.2: IC7.3 29.36,17.36 28.75,16.75 28.75,14.15 D1.A R32.1
N$34
  Top 0.2: R32.2 33.75,14.3 33.75,18.25 34.13,18.64 IC7.7 38.12,18.64 38.25,18.5 41.88,18.5 42.12,18.25 42.12,16.62 41.75,16.25 41.75,15.4 T2.1
N$35  (via drill 0.6)
  Top 0.2: T4.3 T5.3 v37.25,22 | IC7.4 32.09,16.09 32.5,16.5 32.5,19.25 32.95,19.7 R35.2 v31.5,22
  Bottom 0.2: v37.25,22 v31.5,22
N$36
  Top 0.2: IC7.2 28.41,18.64 R33.2 | C8.1 R33.2 | R33.2 R34.2
N$37
  Top 0.2: T4.1 48.3,21.05 48.75,21.5 R37.2
N$38
  Top 0.2: D2.K 45.5,16.5 46.5,15.5 48.92,15.5 C9.1 49,14.5 49.58,13.92 R39.1
N$39
  Top 0.2: C10.1 53,13.5 52.5,13 52.5,12.08 R39.2 52.25,11.83 52.25,10.5 48,6.25 JP1.1
N$40
  Top 0.2: D2.A 43.64,9.14 43.5,9 43.5,7.5 U$20.P$2 40.75,7.25 T2.3
N$41
  Top 0.2: JP2.1 54,6.25 54.75,7 54.75,8.67 R40.2 54.75,8.83 54.75,10.25 55.5,11 R41.1
N$42
  Top 0.2: T3.1 57.73,11.45 R41.2 57.95,11.03 D3.K
N$44  (via drill 0.6)
  Top 0.2: T2.2 39.8,17.4 R36.2 41.2,17.45 v41.25,17.5 | v42.5,21 41.15,21 T5.1
  Bottom 0.2: v41.25,17.5 42.75,17.5 43.5,18.25 43.5,20.5 43,21 v42.5,21
N$45
  Top 0.2: U$17.1 50.1,59.15 49.25,60 48.3,60 C11.2
N$46  (via drill 0.6)
  Top 0.4: IC10.7 71.2,39.8 v72,39
  Bottom 0.4: v72,39 C24.2
N$48  (via drill 0.6)
  Top 0.2: U1.3 50.75,37.38 51,37.12 52.12,37.12 52.38,37.38 54,37.38 55.12,36.25 v56,36.25 | v58.38,17.12 63.62,17.12 64.88,18.38 67.12,18.38 JP7.2
  Bottom 0.2: v56,36.25 56,33.5 58.38,31.12 v58.38,17.12
N$51
  Top 0.2: U2.2 23.62,65.17 C12.2
N$52
  Top 0.2: U$19.10 41.25,63.5 40.5,64.25 37.75,64.25 37.5,64 C13.2
N$53
  Top 0.2: 39.95,65.5 C14.1 40.95,66.5 42.5,66.5 43,66 U$19.8
N$54
  Top 0.2: U$19.12 42.38,61.63 42,61.25 40.5,61.25 39.75,62 C14.2
N$55
  Top 0.2: C5.1 86,72 U$21.3
N$56
  Top 0.2: C4.1 83.42,68.58 U$22.3
N$57  (via drill 0.6)
  Top 0.2: IC10.18 65.2,34.2 64.88,33.88 v62.62,33.88 62.5,34 | v62.5,15.75 67,15.75 JP8.2
  Bottom 0.2: v62.62,33.88 62.62,25.75 60.25,23.38 60.25,18 v62.5,15.75
N$58
  Top 0.2: C3.1 84.5,65 85.75,63.75 85.75,58.75 83.75,56.75 83.75,54 85,52.75 85.98,52.75 JP3.2
N$59
  Top 0.2: C2.1 83.42,58.42 83,58 | 83,58 83,46.25 84.5,44.75 85.98,44.75 JP4.2 | R38.2 83,58
PD_CK  (via drill 0.6)
  Top 0.2: U1.29 48.25,27.25 51.5,24 61.25,24 v62.25,23 | 66.25,30.95 IC10.22 66.2,30.55 v66.75,30 | JP6.3 74,11.25 73,10.25 v65.25,10.25
  Bottom 0.2: v66.75,30 66.75,27.5 v62.25,23 63.75,21.5 63.75,11.88 65.25,10.38 v65.25,10.25
PD_DA  (via drill 0.6)
  Top 0.2: U1.39 62.25,32.25 62.7,31.8 IC10.21 67.7,31.8 v68,31.5 | v64.75,12.5 64.75,11.5 64.25,11 64.25,9.75 64.75,9.25 77.75,9.25 79,10.5 79,11.73 JP6.1
  Bottom 0.2: v68,31.5 68,28 64.75,24.75 v64.75,12.5
RST
  Top 0.2: JP6.2 76.54,12.51 R42.2
  Bottom 0.2: JP6.2 75.1,13.25 66.75,13.25 66.25,13.75 JP8.1 JP7.1
RX  (via drill 0.6)
  Top 0.2: IC10.24 68.8,28.3 68.5,28 66.75,28 64.75,30 59.75,30 v59.25,30.5 | U1.46 54.12,35.75 55.25,34.62 v57.12,34.62
  Bottom 0.2: v57.12,34.62 57.12,33.25 59.25,31.12 v59.25,30.5
SCK  (via drill 0.6)
  Top 0.2: U1.22 43.38,32.25 v42.25,33.38 | v42.5,43.75 42.5,50.57 U$3.9 | IC10.14 64.88,37.4 v64.38,37.88 63.75,38.5 58.88,38.5 54.88,42.5 49.25,42.5 v48.75,42 | IC2.15 70.64,68.75 69.25,68.75 69,68.5 69,64.38 69.12,64.25 71.75,64.25 72.25,63.88 72.25,62.75 71.86,62.37 IC3.7 68.86,62.37 68.25,61.75 68.25,46.25 68.5,46 68.5,43.75 v68.75,43.5
  Bottom 0.2: v42.25,33.38 42.25,39 | 42.25,39 42.25,43.5 v42.5,43.75 | v48.75,42 45.75,39 42.25,39 | v68.75,43.5 68.75,42.25 v64.38,37.88
SCL  (via drill 0.6)
  Top 0.2: U1.15 38.5,35.75 v37.75,35 | IC10.44 77.8,42.8 80.75,45.75 80.75,53 v80,53.75 | v63,62 63,60.05 R44.2 63,59.95 63,59.5 | v38.5,54.62 39,55.12 v39,56.75 | U$34.14 v58,56.62 | U$17.3 53.13,56.87 v53.25,56.75 | U$19.1 45.5,62.5 45.75,62.25 v45.75,56.62 | v32.75,57 32.62,57.13 IC5.6 32.62,61.38 32,62 27.75,62 27.59,61.84 U$18.4 27.46,61.25 26.75,61.25 25.7,62.3 U2.8
  Bottom 0.2: v37.75,35 37.75,49 38.5,49.75 v38.5,54.62 | v80,53.75 66,53.75 63.38,56.38 63,56.38 | 63,56.38 62.5,56.38 62.38,56.25 58,56.25 | 58,56.25 53.25,56.25 | 53.25,56.25 45.75,56.25 | 45.75,56.25 39,56.25 | 39,56.25 33.25,56.25 v32.75,57 30,57 29.38,57.62 27.25,57.62 26.62,57 JP10.2 | v39,56.75 39,56.25 | 63,56.38 v63,62 | v58,56.62 58,56.25 | v53.25,56.75 53.25,56.25 | v45.75,56.62 45.75,56.25
SDA  (via drill 0.6)
  Top 0.2: U1.16 39.75,35.25 38.25,33.75 37.5,33.75 v36.25,35 | IC10.1 76,42.25 79.25,45.5 v79.25,52.75 | 62.7,57.25 R43.2 63,56.95 v63,55.5 | v57,55.12 U$34.13 55.51,60.25 U$17.4 | U$19.16 v44.5,55.12 | v31.5,54.75 31.34,54.91 IC5.5 31.25,60 30,60 29.49,60.51 | U$18.5 29.49,60.51 | U2.7 23.62,61.88 25.5,60 28.98,60 29.49,60.51
  Bottom 0.2: v36.25,35 36.25,49.5 36,49.75 36,55.5 | v79.25,52.75 65.75,52.75 v63,55.5 57,55.5 | 57,55.5 44.5,55.5 | 44.5,55.5 36,55.5 | 36,55.5 32.25,55.5 v31.5,54.75 29.75,56.5 JP10.1 | v57,55.12 57,55.5 | v44.5,55.12 44.5,55.5
TX  (via drill 0.6)
  Top 0.2: IC10.23 67.7,29.2 67.5,29 66.5,29 65,30.5 61,30.5 v60.12,31.5 | U1.47 54.25,36.25 55,35.5 57.5,35.5 v58.25,34.75
  Bottom 0.2: v58.25,34.75 58.25,33.38 v60.12,31.5

### Text on the board
Bottom: JJTC_MAIN_v1